# Altium project Base18 3V-to-5V.PrjPCB
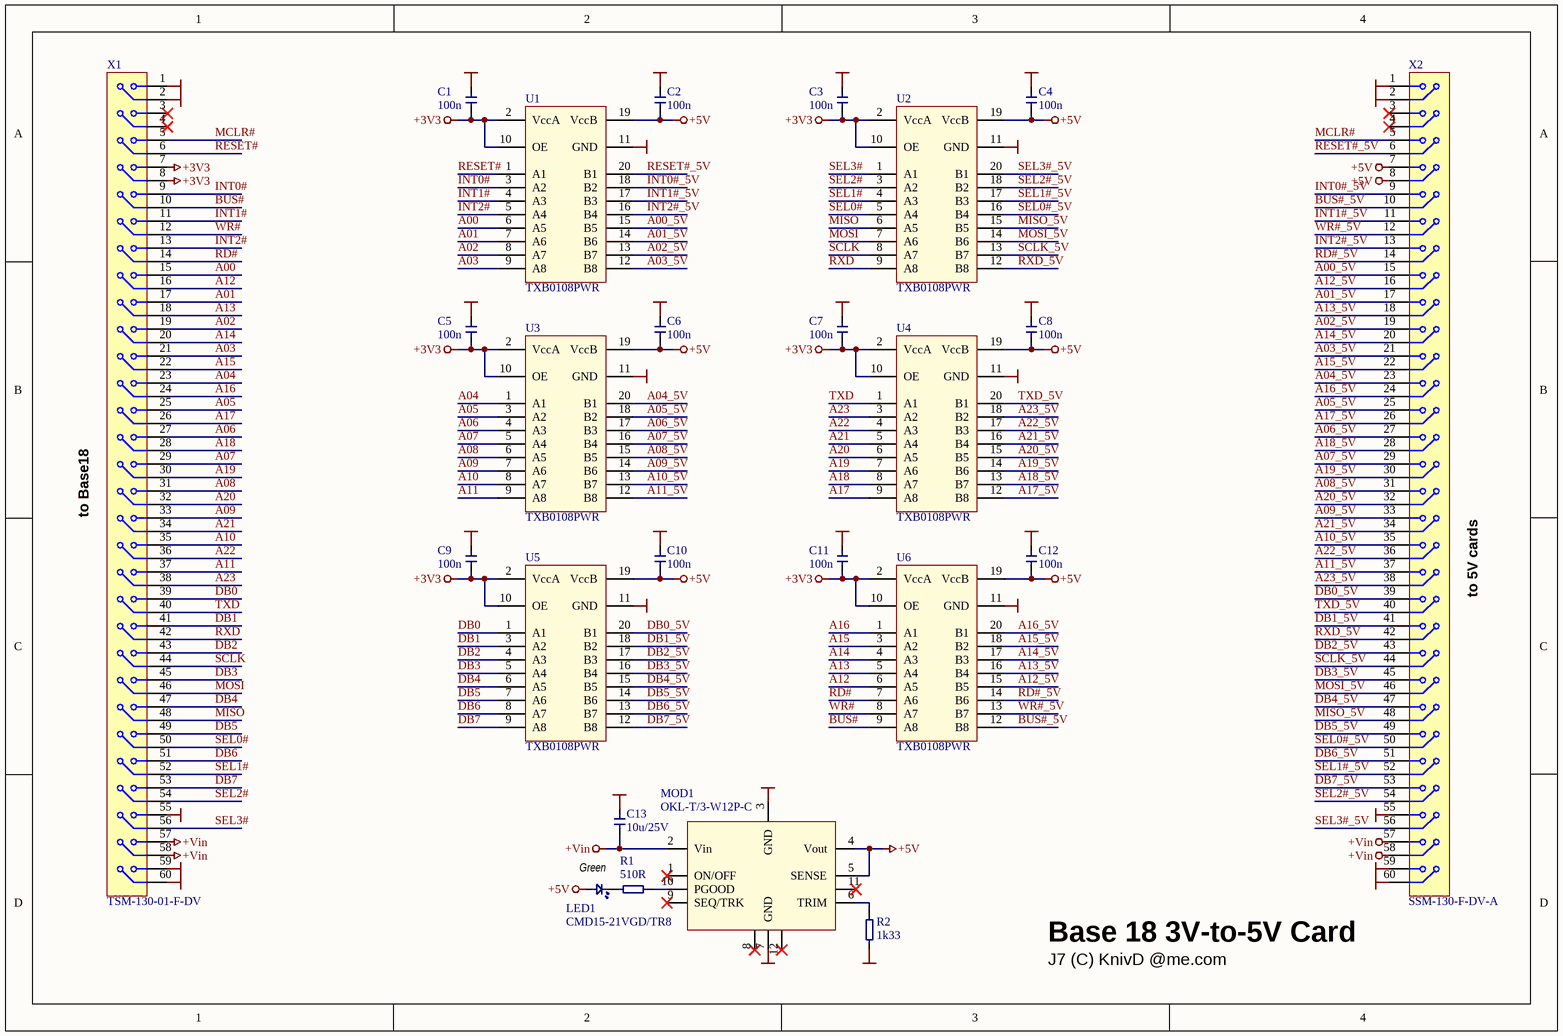
[diagram p0: Sheet1.SchDoc]
1 sheet, 25 parts. Net scope: global (net labels, ports and power ports of the same name join across sheets).
Board file: PCB1.PcbDoc

## Sheet Sheet1.SchDoc
size A4

### Parts
C1  100n  [CAPC3216X110N]
C2  100n  [CAPC3216X110N]
C3  100n  [CAPC3216X110N]
C4  100n  [CAPC3216X110N]
C5  100n  [CAPC3216X110N]
C6  100n  [CAPC3216X110N]
C7  100n  [CAPC3216X110N]
C8  100n  [CAPC3216X110N]
C9  100n  [CAPC3216X110N]
C10  100n  [CAPC3216X110N]
C11  100n  [CAPC3216X110N]
C12  100n  [CAPC3216X110N]
C13  10u/25V  [CAPC3216X110N]
LED1  CMD15-21VGD/TR8  [LED_OSRAM_LGN971]
MOD1  OKL-T/3-W12P-C  [OKL-T/3-W12]
R1  510R  [RESC3216X75N]
R2  1k33  [RESC3216X75N]
U1  TXB0108PWR  [SOP65P640X120-20N]
U2  TXB0108PWR  [SOP65P640X120-20N]
U3  TXB0108PWR  [SOP65P640X120-20N]
U4  TXB0108PWR  [SOP65P640X120-20N]
U5  TXB0108PWR  [SOP65P640X120-20N]
U6  TXB0108PWR  [SOP65P640X120-20N]
X1  TSM-130-01-F-DV  [2015-2X30XD-M]
X2  SSM-130-F-DV-A  [2015-2X30XD-F]

### Nets
+3V3: C1.1 C3.1 C5.1 C7.1 C9.1 C11.1 U1.2(VccA) U1.10(OE) U2.2(VccA) U2.10(OE) U3.2(VccA) U3.10(OE) U4.2(VccA) U4.10(OE) U5.2(VccA) U5.10(OE) U6.2(VccA) U6.10(OE) X1.7 X1.8
+5V: C2.1 C4.1 C6.1 C8.1 C10.1 C12.1 LED1.2 MOD1.4(Vout) MOD1.5(SENSE) U1.19(VccB) U2.19(VccB) U3.19(VccB) U4.19(VccB) U5.19(VccB) U6.19(VccB) X2.7 X2.8
+Vin: C13.2 MOD1.2(Vin) X1.57 X1.58 X2.57 X2.58
GND: C1.2 C2.2 C3.2 C4.2 C5.2 C6.2 C7.2 C8.2 C9.2 C10.2 C11.2 C12.2 C13.1 MOD1.3(GND) MOD1.7(GND) R2.1 U1.11(GND) U2.11(GND) U3.11(GND) U4.11(GND) U5.11(GND) U6.11(GND) X1.1 X1.2 X1.55 X1.59 X1.60 X2.1 X2.2 X2.55 X2.59 X2.60
A00: U1.6(A5) X1.15
A00_5V: U1.15(B5) X2.15
A01: U1.7(A6) X1.17
A01_5V: U1.14(B6) X2.17
A02: U1.8(A7) X1.19
A02_5V: U1.13(B7) X2.19
A03: U1.9(A8) X1.21
A03_5V: U1.12(B8) X2.21
A04: U3.1(A1) X1.23
A04_5V: U3.20(B1) X2.23
A05: U3.3(A2) X1.25
A05_5V: U3.18(B2) X2.25
A06: U3.4(A3) X1.27
A06_5V: U3.17(B3) X2.27
A07: U3.5(A4) X1.29
A07_5V: U3.16(B4) X2.29
A08: U3.6(A5) X1.31
A08_5V: U3.15(B5) X2.31
A09: U3.7(A6) X1.33
A09_5V: U3.14(B6) X2.33
A10: U3.8(A7) X1.35
A10_5V: U3.13(B7) X2.35
A11: U3.9(A8) X1.37
A11_5V: U3.12(B8) X2.37
A12: U6.6(A5) X1.16
A12_5V: U6.15(B5) X2.16
A13: U6.5(A4) X1.18
A13_5V: U6.16(B4) X2.18
A14: U6.4(A3) X1.20
A14_5V: U6.17(B3) X2.20
A15: U6.3(A2) X1.22
A15_5V: U6.18(B2) X2.22
A16: U6.1(A1) X1.24
A16_5V: U6.20(B1) X2.24
A17: U4.9(A8) X1.26
A17_5V: U4.12(B8) X2.26
A18: U4.8(A7) X1.28
A18_5V: U4.13(B7) X2.28
A19: U4.7(A6) X1.30
A19_5V: U4.14(B6) X2.30
A20: U4.6(A5) X1.32
A20_5V: U4.15(B5) X2.32
A21: U4.5(A4) X1.34
A21_5V: U4.16(B4) X2.34
A22: U4.4(A3) X1.36
A22_5V: U4.17(B3) X2.36
A23: U4.3(A2) X1.38
A23_5V: U4.18(B2) X2.38
BUS#: U6.9(A8) X1.10
BUS#_5V: U6.12(B8) X2.10
DB0: U5.1(A1) X1.39
DB0_5V: U5.20(B1) X2.39
DB1: U5.3(A2) X1.41
DB1_5V: U5.18(B2) X2.41
DB2: U5.4(A3) X1.43
DB2_5V: U5.17(B3) X2.43
DB3: U5.5(A4) X1.45
DB3_5V: U5.16(B4) X2.45
DB4: U5.6(A5) X1.47
DB4_5V: U5.15(B5) X2.47
DB5: U5.7(A6) X1.49
DB5_5V: U5.14(B6) X2.49
DB6: U5.8(A7) X1.51
DB6_5V: U5.13(B7) X2.51
DB7: U5.9(A8) X1.53
DB7_5V: U5.12(B8) X2.53
INT0#: U1.3(A2) X1.9
INT0#_5V: U1.18(B2) X2.9
INT1#: U1.4(A3) X1.11
INT1#_5V: U1.17(B3) X2.11
INT2#: U1.5(A4) X1.13
INT2#_5V: U1.16(B4) X2.13
MCLR#: X1.5 X2.5
MISO: U2.6(A5) X1.48
MISO_5V: U2.15(B5) X2.48
MOSI: U2.7(A6) X1.46
MOSI_5V: U2.14(B6) X2.46
RD#: U6.7(A6) X1.14
RD#_5V: U6.14(B6) X2.14
RESET#: U1.1(A1) X1.6
RESET#_5V: U1.20(B1) X2.6
RXD: U2.9(A8) X1.42
RXD_5V: U2.12(B8) X2.42
SCLK: U2.8(A7) X1.44
SCLK_5V: U2.13(B7) X2.44
SEL0#: U2.5(A4) X1.50
SEL0#_5V: U2.16(B4) X2.50
SEL1#: U2.4(A3) X1.52
SEL1#_5V: U2.17(B3) X2.52
SEL2#: U2.3(A2) X1.54
SEL2#_5V: U2.18(B2) X2.54
SEL3#: U2.1(A1) X1.56
SEL3#_5V: U2.20(B1) X2.56
TXD: U4.1(A1) X1.40
TXD_5V: U4.20(B1) X2.40
WR#: U6.8(A7) X1.12
WR#_5V: U6.13(B7) X2.12
NetLED1_1: LED1.1 R1.2
NetMOD1_6: MOD1.6(TRIM) R2.2
NetMOD1_10: MOD1.10(PGOOD) R1.1

Not connected (* = marked no-connect by the designer): MOD1 1(ON/OFF)* 8* 9(SEQ/TRK)* 11* 12*; X1 3* 4*; X2 3* 4*

### Notes on the sheet
- to Base18
- to 5V cards
- Green
- Base 18 3V-to-5V Card
- J7 (C) KnivD @me.com

### Library data of the parts
C1-C13 = Capacitor
  C13: Note: 10u/25V
LED1 = LED: Light Emitting Diode
MOD1 = OKL-T/3-W12: Programmable Output 3-Amp iLGA SMT PoLs; Manufacturer: Murata
R1 R2 = Resistor
U1-U6 = TXB0108PWR: 8-bit bidirectional voltage translator; Manufacturer: Texas Instruments
X1 X2 = Connector 2x30: Dual row, 60-way connector